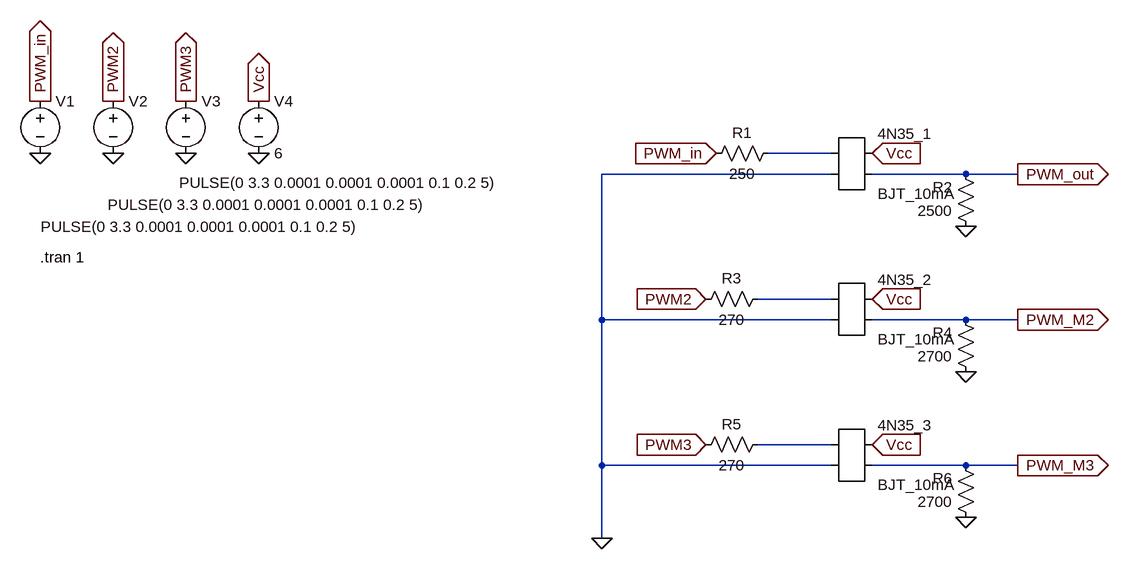
[diagram p0: schematic Opto-Isolation.asc]
Opto-Isolation.asc, the LTspice schematic file:
Version 4
SHEET 1 880 932
WIRE 128 128 32 128
WIRE 128 160 -224 160
WIRE 336 160 192 160
WIRE 416 160 336 160
WIRE 128 352 16 352
WIRE -224 384 -224 160
WIRE 128 384 -224 384
WIRE 336 384 192 384
WIRE 416 384 336 384
WIRE 128 576 16 576
WIRE -224 608 -224 384
WIRE 128 608 -224 608
WIRE 336 608 192 608
WIRE 416 608 336 608
WIRE -224 720 -224 608
FLAG 336 240 0
FLAG 336 464 0
FLAG 336 688 0
FLAG -224 720 0
FLAG -48 128 PWM_in
IOPIN -48 128 In
FLAG -64 352 PWM2
IOPIN -64 352 In
FLAG -64 576 PWM3
IOPIN -64 576 In
FLAG -864 128 0
FLAG -976 128 0
FLAG -1088 128 0
FLAG -752 128 0
FLAG -1088 48 PWM_in
IOPIN -1088 48 Out
FLAG -976 48 PWM2
IOPIN -976 48 Out
FLAG -864 48 PWM3
IOPIN -864 48 Out
FLAG -752 48 Vcc
IOPIN -752 48 Out
FLAG 192 128 Vcc
IOPIN 192 128 In
FLAG 192 352 Vcc
IOPIN 192 352 In
FLAG 192 576 Vcc
IOPIN 192 576 In
FLAG 416 160 PWM_out
IOPIN 416 160 Out
FLAG 416 384 PWM_M2
IOPIN 416 384 Out
FLAG 416 608 PWM_M3
IOPIN 416 608 Out
SYMBOL res 48 112 R90
WINDOW 0 0 56 VBottom 2
WINDOW 3 32 56 VTop 2
SYMATTR InstName R1
SYMATTR Value 250
SYMBOL res 352 256 R180
WINDOW 0 36 76 Left 2
WINDOW 3 36 40 Left 2
SYMATTR InstName R2
SYMATTR Value 2500
SYMBOL res -80 368 R270
WINDOW 0 32 56 VTop 2
WINDOW 3 0 56 VBottom 2
SYMATTR InstName R3
SYMATTR Value 270
SYMBOL res 352 480 R180
WINDOW 0 36 76 Left 2
WINDOW 3 36 40 Left 2
SYMATTR InstName R4
SYMATTR Value 2700
SYMBOL res 32 560 R90
WINDOW 0 0 56 VBottom 2
WINDOW 3 32 56 VTop 2
SYMATTR InstName R5
SYMATTR Value 270
SYMBOL res 352 704 R180
WINDOW 0 36 76 Left 2
WINDOW 3 36 40 Left 2
SYMATTR InstName R6
SYMATTR Value 2700
SYMBOL voltage -1088 32 R0
WINDOW 3 1 209 Left 2
WINDOW 123 0 0 Left 0
WINDOW 39 0 0 Left 0
SYMATTR Value PULSE(0 3.3 0.0001 0.0001 0.0001 0.1 0.2 5)
SYMATTR InstName V1
SYMBOL voltage -976 32 R0
WINDOW 3 -8 175 Left 2
WINDOW 123 0 0 Left 0
WINDOW 39 0 0 Left 0
SYMATTR Value PULSE(0 3.3 0.0001 0.0001 0.0001 0.1 0.2 5)
SYMATTR InstName V2
SYMBOL voltage -864 32 R0
WINDOW 3 -10 141 Left 2
WINDOW 123 0 0 Left 0
WINDOW 39 0 0 Left 0
SYMATTR Value PULSE(0 3.3 0.0001 0.0001 0.0001 0.1 0.2 5)
SYMATTR InstName V3
SYMBOL voltage -752 32 R0
WINDOW 123 0 0 Left 0
WINDOW 39 0 0 Left 0
SYMATTR InstName V4
SYMATTR Value 6
SYMBOL AutoGenerated\\BJT_10mA 160 144 R0
SYMATTR InstName 4N35_1
SYMBOL AutoGenerated\\BJT_10mA 160 368 R0
SYMATTR InstName 4N35_2
SYMBOL AutoGenerated\\BJT_10mA 160 592 R0
SYMATTR InstName 4N35_3
TEXT -1088 288 Left 2 !.tran 1

The netlist it stands for:
* Opto-Isolation.asc
R1 N001 PWM_in 250
R2 0 PWM_out 2500
R3 PWM2 N002 270
R4 0 PWM_M2 2700
R5 N003 PWM3 270
R6 0 PWM_M3 2700
V1 PWM_in 0 PULSE(0 3.3 0.0001 0.0001 0.0001 0.1 0.2 5)
V2 PWM2 0 PULSE(0 3.3 0.0001 0.0001 0.0001 0.1 0.2 5)
V3 PWM3 0 PULSE(0 3.3 0.0001 0.0001 0.0001 0.1 0.2 5)
V4 Vcc 0 6
* 4N35_1: BJT_10mA (symbol AutoGenerated\BJT_10mA not available, pins judged from their places): pin1=N001 pin2=0 pin3=Vcc pin4=PWM_out
* 4N35_2: BJT_10mA (symbol AutoGenerated\BJT_10mA not available, pins judged from their places): pin1=N002 pin2=0 pin3=Vcc pin4=PWM_M2
* 4N35_3: BJT_10mA (symbol AutoGenerated\BJT_10mA not available, pins judged from their places): pin1=N003 pin2=0 pin3=Vcc pin4=PWM_M3
.tran 1
.backanno
.end